# Altium schematic sheet DHT11.SchDoc
size A
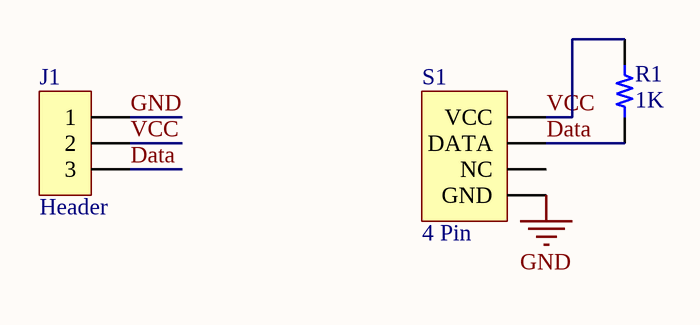
[diagram p0: DHT11.SchDoc]

## Parts
J1  Header  [MOLEX SDA-70553-3PIN]
R1  1K  [RES 1206/3216]
S1  4 Pin  [DHT11]

## Nets
GND: J1.1 S1.4(GND)
Data: J1.3 R1.1 S1.2(DATA)
VCC: J1.2 R1.2 S1.1(VCC)

Not connected (* = marked no-connect by the designer): S1 3(NC)

## Library data of the parts
J1 = 3 Pin
R1 = Resistor: SMT Resistor; Value: 1K
S1 = DHT11